# Altium schematic sheet microcontroller.SchDoc: microcontroller
size A2; CheckedBy: DMH; Organization: Detex Corp; Address1: Detex Corp; Address2: 302 Detex Dr; Address3: New Braunfels, TX 78130; Address4: (830) 629-290; DocumentNumber: 107027; Revision: A1; SheetNumber: 2; SheetTotal: 5; ProjectName: EE Project - 1.17.2021.PrjPcb
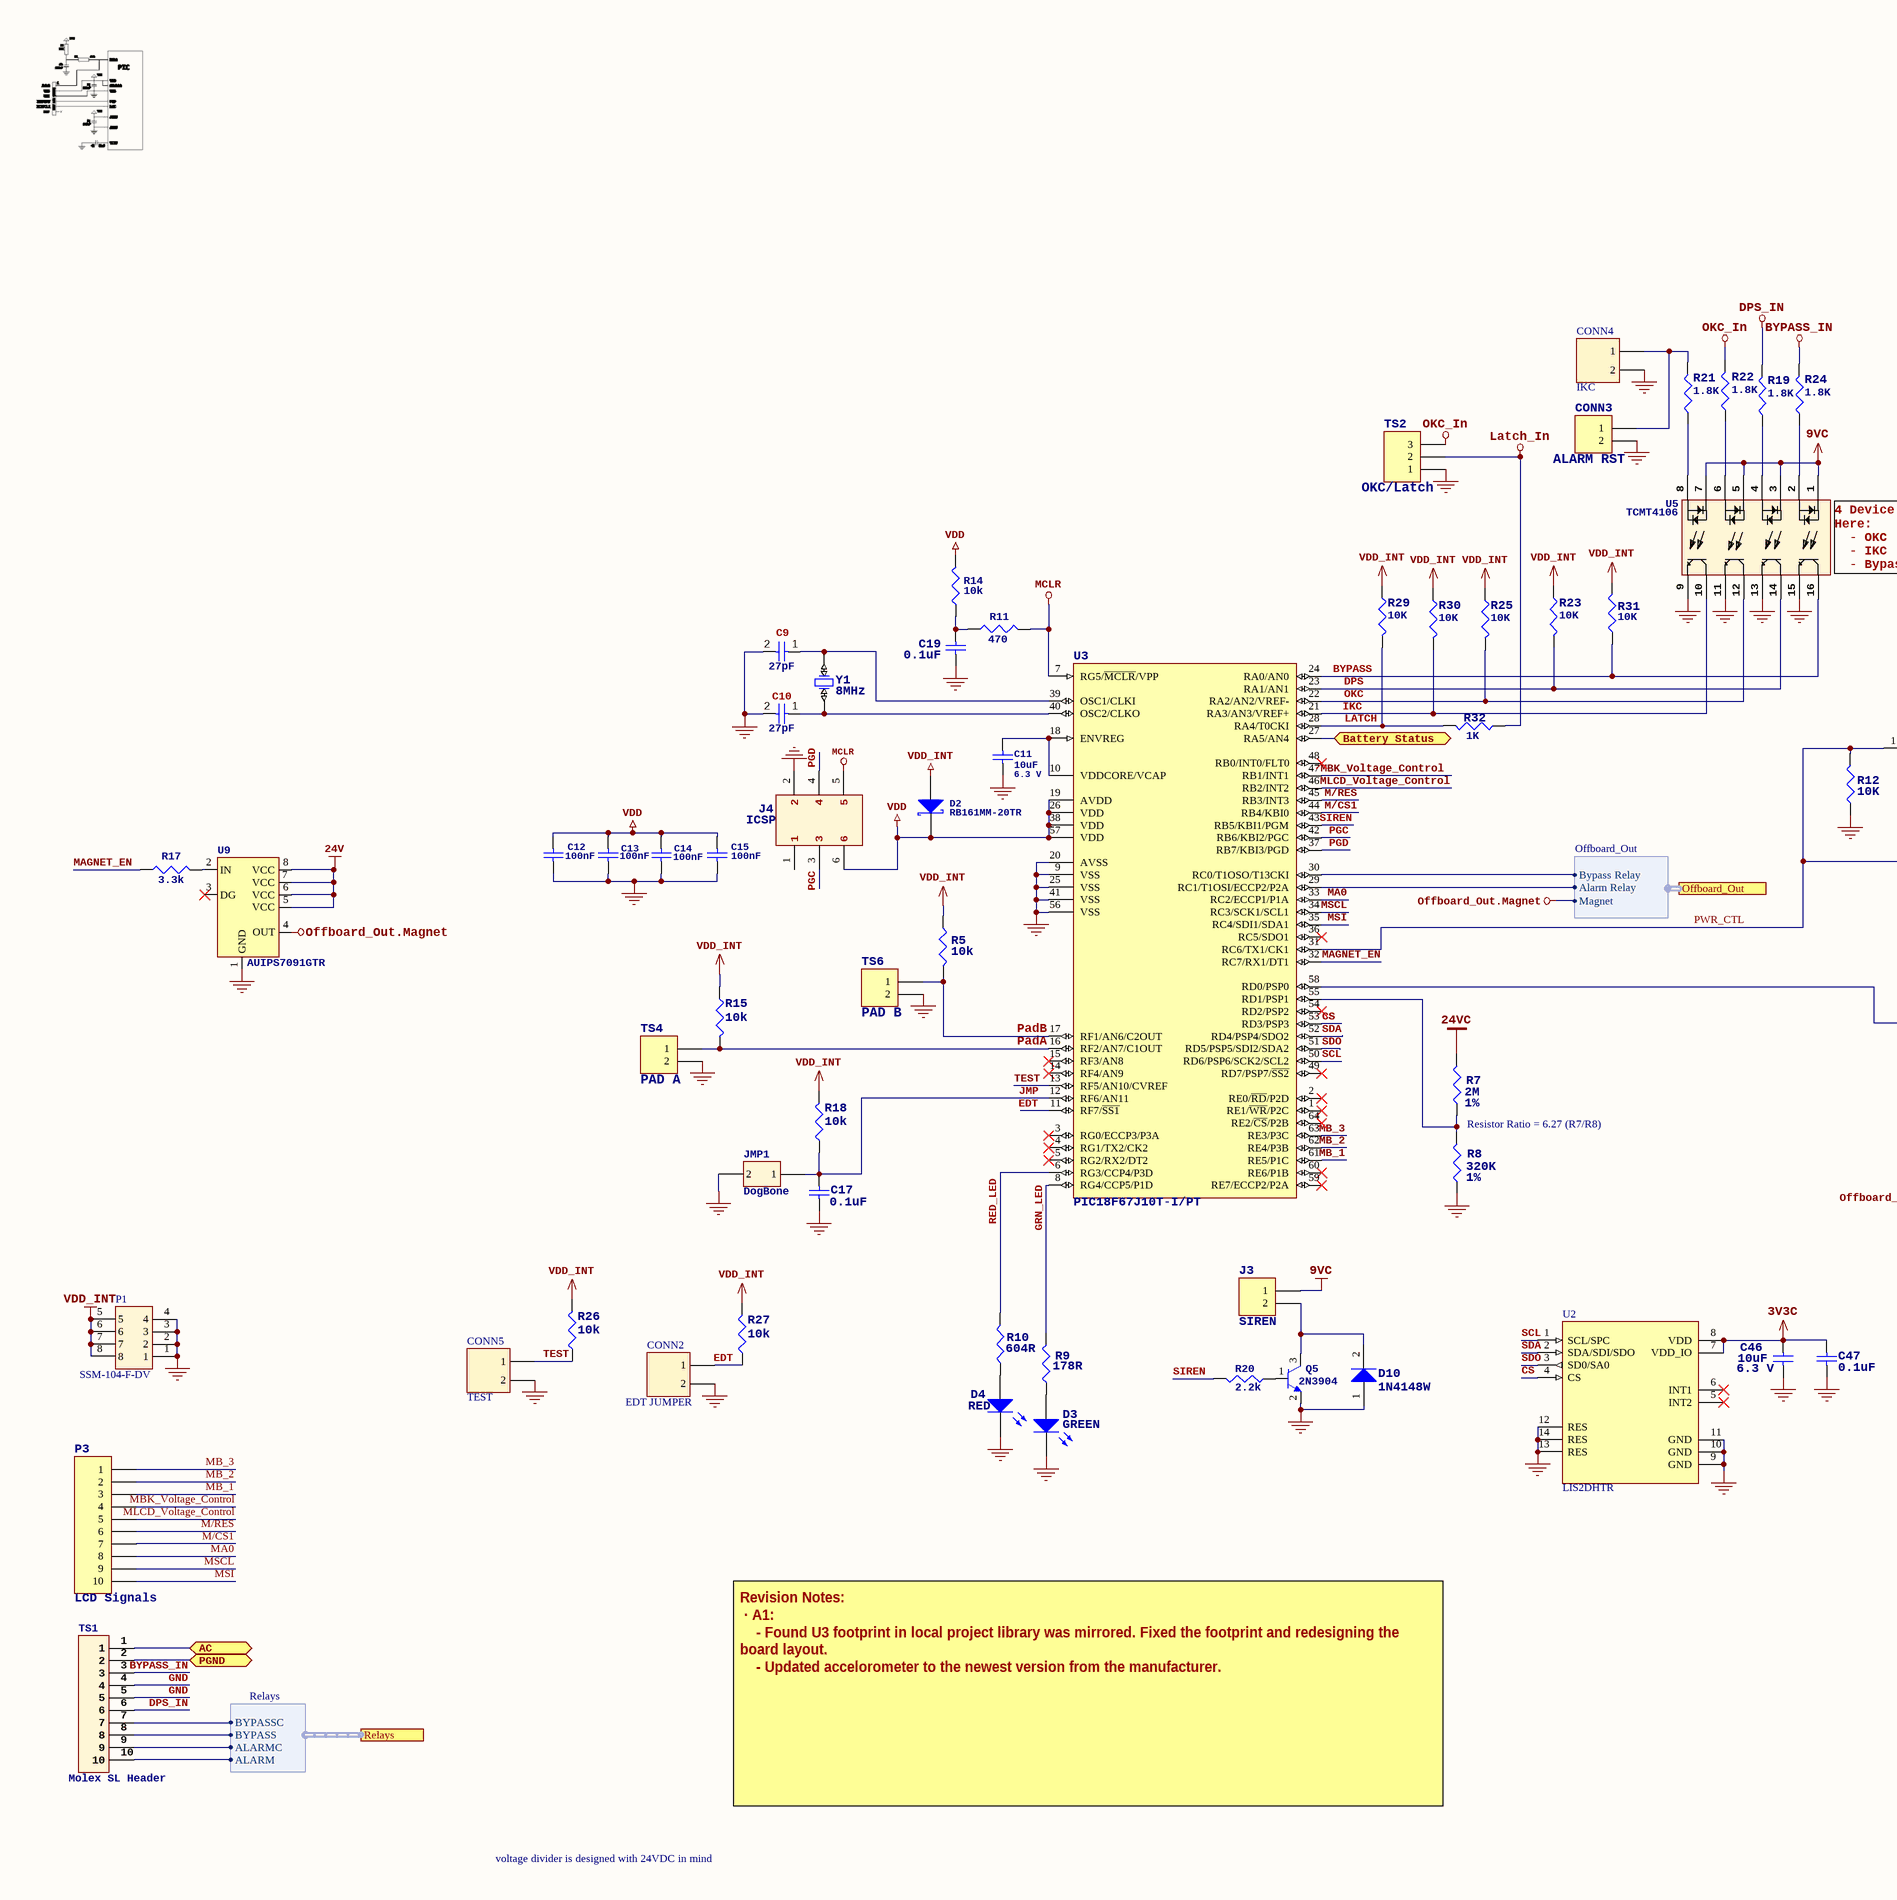
[diagram p0: microcontroller.SchDoc, left]
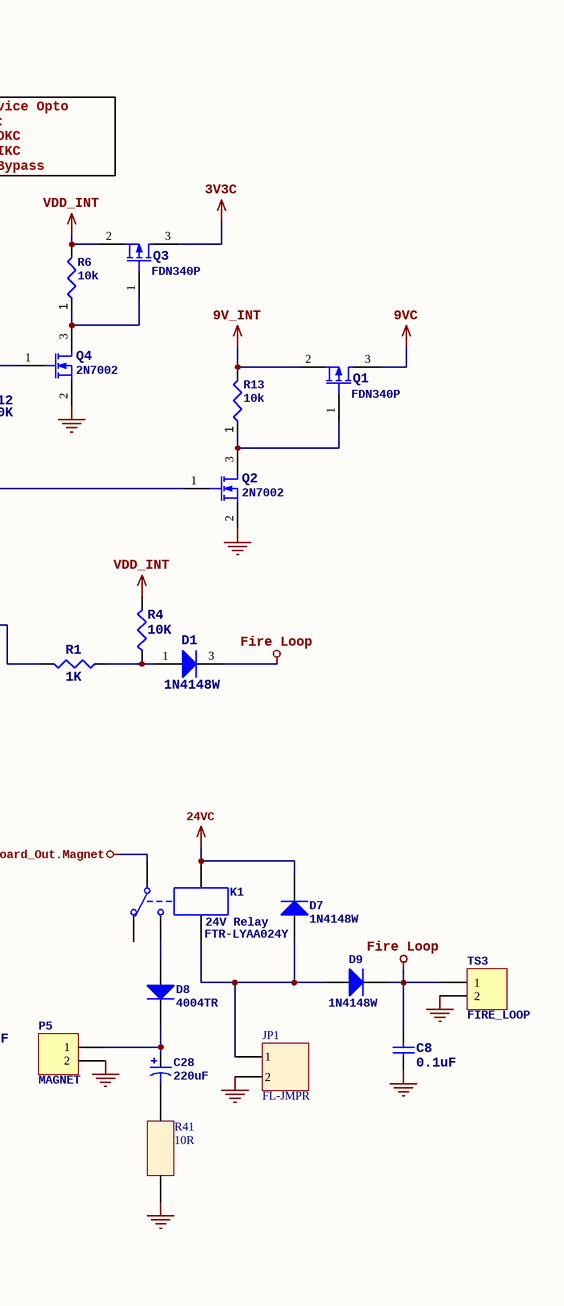
[diagram p1: microcontroller.SchDoc, right]

## Parts
C8  value 0.1uF  [C0805]  (hidden comment: Cap)
C9  value 27pF  [C0805]  (hidden comment: Cap)
C10  value 27pF  [C0805]  (hidden comment: Cap)
C11  value 10uF  Voltage: 6.3 V  [C0805]  (hidden comment: Cap)
C12  value 100nF  [C0805]  (hidden comment: Cap)
C13  value 100nF  [C0805]  (hidden comment: Cap)
C14  value 100nF  [C0805]  (hidden comment: Cap)
C15  value 100nF  [C0805]  (hidden comment: Cap)
C17  value 0.1uF  [C0805]  (hidden comment: Cap)
C19  value 0.1uF  [C0805]  (hidden comment: Cap)
C28  value 220uF  [10x12.5 CAP]  (hidden comment: Cap Pol3)
C46  value 10uF  Voltage: 6.3 V  [C0805]  (hidden comment: Cap)
C47  value 0.1uF  [C0805]  (hidden comment: Cap)
CONN2  EDT JUMPER  [2 Pin Header]
CONN3  ALARM RST  [BAT-2]  (no BOM)
CONN4  IKC  [2 Pin Header]
CONN5  TEST  [2 Pin Header]
D1  MFR P/N: 1N4148W  [SOT-23_M]  (hidden comment: Diode)
D2  MFR P/N: RB161MM-20TR  [SOD-123FL]  (hidden comment: D Schottky)
D3  GREEN  [T-1 3/4]
D4  RED  [T-1 3/4]
D7  MFR P/N: 1N4148W  [SOT-23_M]  (hidden comment: Diode)
D8  MFR P/N: 4004TR  [SMB]  (hidden comment: Diode)
D9  MFR P/N: 1N4148W  [SOT-23_M]  (hidden comment: Diode)
D10  MFR P/N: 1N4148W  [SOT-23_M]  (hidden comment: Diode)
J3  SIREN  [BAT-2]  (no BOM)
J4  ICSP  [ICSP SMT]  (no BOM)
JMP1  DogBone  [DogBone]  (no BOM)
JP1  FL-JMPR  [2 Pin Header]
K1  24V Relay  MFR P/N: FTR-LYAA024Y  [FTR-LY]
P1  MFR P/N: SSM-104-F-DV  [MOLEX 15453508]  (hidden comment: LCD Power)
P3  LCD Signals  [10 pin Header]
P5  MAGNET  [7025]
Q1  FDN340P  [SOT-23_N]
Q2  2N7002  [SOT-23_N]
Q3  FDN340P  [SOT-23_N]
Q4  2N7002  [SOT-23_N]
Q5  2N3904  [SOT-23_N]
R1  value 1K  [6-0805_N]  (hidden comment: Res3)
R4  value 10K  [6-0805_N]  (hidden comment: Res3)
R5  value 10k  [6-0805_N]  (hidden comment: Res3)
R6  value 10k  [6-0805_N]  (hidden comment: Resistor 10k +/-1% 0805)
R7  1%  value 2M  [6-0805_N]
R8  1%  value 320K  [6-0805_N]
R9  value 178R  [6-0805_N]  (hidden comment: Res3)
R10  value 604R  [6-0805_N]  (hidden comment: Res3)
R11  value 470  [6-0805_N]  (hidden comment: Resistor 1k +/-1% 0603 100 mW)
R12  value 10K  [6-0805_N]  (hidden comment: Res3)
R13  value 10k  [6-0805_N]  (hidden comment: Resistor 10k +/-1% 0805)
R14  value 10k  [6-0805_N]  (hidden comment: Resistor 10k +/-1% 0805)
R15  value 10k  [6-0805_N]  (hidden comment: Res3)
R17  value 3.3k  [6-0805_N]  (hidden comment: Res3)
R18  value 10k  [6-0805_N]  (hidden comment: Res3)
R19  value 1.8K  [6-0805_N]  (hidden comment: Res3)
R20  value 2.2k  [6-0805_N]  (hidden comment: Resistor 2.2k +/-5% 0805)
R21  value 1.8K  [6-0805_N]  (hidden comment: Res3)
R22  value 1.8K  [6-0805_N]  (hidden comment: Res3)
R23  value 10K  [6-0805_N]  (hidden comment: Res3)
R24  value 1.8K  [6-0805_N]  (hidden comment: Res3)
R25  value 10K  [6-0805_N]  (hidden comment: Res3)
R26  value 10k  [6-0805_N]  (hidden comment: Res3)
R27  value 10k  [6-0805_N]  (hidden comment: Res3)
R29  value 10K  [6-0805_N]  (hidden comment: Res3)
R30  value 10K  [6-0805_N]  (hidden comment: Res3)
R31  value 10K  [6-0805_N]  (hidden comment: Res3)
R32  value 1K  [6-0805_N]  (hidden comment: Res3)
R41  10R  [RESC_1210]
TS1  Molex SL Header  [10 Pin Molex Horizontal - duplicate]
TS2  OKC/Latch  [3 Pin Footprint]
TS3  FIRE_LOOP  [BAT-2]
TS4  PAD A  [BAT-2]
TS6  PAD B  [BAT-2]
U2  LIS2DHTR  [PQFN35P200X200X100-14N]
U3  PIC18F67J10T-I/PT  [PIC18F67J10T-I/PT]
U5  TCMT4106  [SSOP-16]
U9  AUIPS7091GTR  [SOIC127P600X175-8N]
Y1  8MHz  [ABM3]

## Ports
AC (bidir), Battery Status (bidir), Offboard_Out (harness Offboard_Out), PGND (bidir), Relays (harness Relays)

## Harnesses
Offboard_Out: Alarm Relay, Bypass Relay, Magnet
Relays: ALARMC, ALARM, BYPASSC, BYPASS

## Nets
3V3C: C46.1 C47.1 Q3.3(D) U2.7(VDD_IO) U2.8(VDD)
9V_INT: Q1.2(S) R13.2
9VC: J3.1 Q1.3(D) U5.1 U5.3 U5.5 U5.7
24V: U9.5(VCC) U9.6(VCC) U9.7(VCC) U9.8(VCC)
24VC: D7.2(K) K1.4 R7.2
BYPASS_IN: R24.2 TS1.3
DPS_IN: R19.2 TS1.6
Fire Loop: C8.1 D1.3 D9.2 TS3.1
GND: C8.2 C9.2 C10.2 C11.2 C12.2 C13.2 C14.1 C15.2 C17.2 C19.2 C46.2 C47.2 CONN2.2 CONN3.2 CONN4.2 CONN5.2 D3.2(K) D4.2(K) D10.1 J4.2 JMP1.2 JP1.2 P1.1 P1.2 P1.3 P1.4 P5.2 Q2.2(S) Q4.2(S) Q5.2(E) R8.1 R12.1 R41.2 TS1.4 TS1.5 TS2.1 TS3.2 TS4.2 TS6.2 U2.9(GND) U2.10(GND) U2.11(GND) U2.12(RES) U2.13(RES) U2.14(RES) U3.9(VSS) U3.20(AVSS) U3.25(VSS) U3.41(VSS) U3.56(VSS) U5.9 U5.11 U5.13 U5.15 U9.1(GND)
Latch_In: R32.1 TS2.2
MCLR: J4.5 R11.2 U3.7(RG5/~{MCLR}/VPP)
Offboard_Out.Magnet: K1.1 U9.4(OUT) ; port Offboard_Out.Magnet
OKC_In: R22.2 TS2.3
VDD: C12.1 C13.1 C14.2 C15.1 D2.1 J4.6 R14.2 U3.19(AVDD) U3.26(VDD) U3.38(VDD) U3.57(VDD)
VDD_INT: D2.2 P1.5 P1.6 P1.7 P1.8 Q3.2(S) R4.2 R5.1 R6.2 R15.1 R18.2 R23.1 R25.1 R26.2 R27.2 R29.1 R30.1 R31.2
AC: TS1.1 ; port AC
Battery Status: U3.27(RA5/AN4) ; port Battery Status
BYPASS: R31.1 U3.24(RA0/AN0) U5.16
CS: U2.4(CS) U3.53(RD3/PSP3)
DPS: R23.2 U3.23(RA1/AN1) U5.14
EDT: CONN2.1 R27.1 U3.11(RF7/~{SS1})
GRN_LED: R9.2 U3.8(RG4/CCP5/P1D)
IKC: R30.2 U3.21(RA3/AN3/VREF+) U5.10
JMP: C17.1 JMP1.1 R18.1 U3.12(RF6/AN11)
LATCH: R29.2 R32.2 U3.28(RA4/T0CKI)
M/CS1: P3.7 U3.44(RB4/KBI0)
M/RES: P3.6 U3.45(RB3/INT3)
MA0: P3.8 U3.33(RC2/ECCP1/P1A)
MAGNET_EN: R17.1 U3.32(RC7/RX1/DT1)
MB_1: P3.3 U3.61(RE5/P1C)
MB_2: P3.2 U3.62(RE4/P3B)
MB_3: P3.1 U3.63(RE3/P3C)
MBK_Voltage_Control: P3.4 U3.47(RB1/INT1)
MLCD_Voltage_Control: P3.5 U3.46(RB2/INT2)
MSCL: P3.9 U3.34(RC3/SCK1/SCL1)
MSI: P3.10 U3.35(RC4/SDI1/SDA1)
OKC: R25.2 U3.22(RA2/AN2/VREF-) U5.12
PadA: R15.2 TS4.1 U3.16(RF2/AN7/C1OUT)
PadB: R5.2 TS6.1 U3.17(RF1/AN6/C2OUT)
PGC: J4.3 U3.42(RB6/KBI2/PGC)
PGD: J4.4 U3.37(RB7/KBI3/PGD)
PGND: TS1.2 ; port PGND
PWR_CTL: Q2.1(G) Q4.1(G) R12.2 U3.31(RC6/TX1/CK1)
RED_LED: R10.2 U3.6(RG3/CCP4/P3D)
SCL: U2.1(SCL/SPC) U3.50(RD6/PSP6/SCK2/SCL2)
SDA: U2.2(SDA/SDI/SDO) U3.52(RD4/PSP4/SDO2)
SDO: U2.3(SD0/SA0) U3.51(RD5/PSP5/SDI2/SDA2)
SIREN: R20.2 U3.43(RB5/KBI1/PGM)
TEST: CONN5.1 R26.1 U3.13(RF5/AN10/CVREF)
NetC9_1: C9.1 U3.39(OSC1/CLKI) Y1.1(OSC1)
NetC10_1: C10.1 U3.40(OSC2/CLKO) Y1.2(OSC2)
NetC11_1: C11.1 U3.10(VDDCORE/VCAP) U3.18(ENVREG)
NetC19_1: C19.1 R11.1 R14.1
NetC28_1: C28.1 D8.2(K) P5.1
NetC28_2: C28.2 R41.1
NetCONN3_1: CONN3.1 CONN4.1 R21.2
NetD1_1: D1.1 R1.1 R4.1
NetD3_1: D3.1(A) R9.1
NetD4_1: D4.1(A) R10.1
NetD7_1: D7.1(A) D9.1 JP1.1 K1.5
NetD8_1: D8.1(A) K1.3
NetD10_2: D10.2 J3.2 Q5.3(C)
NetQ1_1: Q1.1(G) Q2.3(D) R13.1
NetQ3_1: Q3.1(G) Q4.3(D) R6.1
NetQ5_1: Q5.1(B) R20.1
NetR1_2: R1.2 U3.58(RD0/PSP0)
NetR7_1: R7.1 R8.2 U3.55(RD1/PSP1)
NetR17_2: R17.2 U9.2(IN)
NetR19_1: R19.1 U5.4
NetR21_1: R21.1 U5.8
NetR22_1: R22.1 U5.6
NetR24_1: R24.1 U5.2
NetTS1_7: TS1.7 ; port Relays.BYPASSC
NetTS1_8: TS1.8 ; port Relays.BYPASS
NetTS1_9: TS1.9 ; port Relays.ALARMC
NetTS1_10: TS1.10 ; port Relays.ALARM
NetU3_29: U3.29(RC1/T1OSI/ECCP2/P2A) ; port Offboard_Out.Alarm Relay
NetU3_30: U3.30(RC0/T1OSO/T13CKI) ; port Offboard_Out.Bypass Relay

Not connected (* = marked no-connect by the designer): J4 1; K1 2; U2 5(INT2)* 6(INT1)*; U3 1(RE1/~{WR}/P2C)* 2(RE0/~{RD}/P2D)* 3(RG0/ECCP3/P3A)* 4(RG1/TX2/CK2)* 5(RG2/RX2/DT2)* 14(RF4/AN9)* 15(RF3/AN8)* 36(RC5/SDO1)* 48(RB0/INT0/FLT0)* 49(RD7/PSP7/~{SS2})* 54(RD2/PSP2)* 59(RE7/ECCP2/P2A)* 60(RE6/P1B)* 64(RE2/~{CS}/P2B)*; U9 3(DG)*

## Notes on the sheet
- (near U5) 4 Device Opto Here:
  - OKC
  - IKC
  - Bypass
  - DPS
- Resistor Ratio = 6.27 (R7/R8)
- Revision Notes:
  ∙ A1:
  - Found U3 footprint in local project library was mirrored. Fixed the footprint and redesigning the board layout.
  - Updated accelorometer to the newest version from the manufacturer.
- voltage divider is designed with 24VDC in mind
- Title
- Detex Corp
- Size:
- Date:
- File:
- A2
- Number:
- Time:
- Sheet
- Revision:
- of
- 302 Detex Drive
- New Braunfels, TX 78130
- (830) 629-2900

## Library data of the parts
C8 C17 C19 C47 = Cap: Capacitor Ceramic X7R 50V 0.1uF 0805 SMT; MFR: KEMET; MFR P/N: C0805C104K4RACTU; Detex P/N: 101727‐7; PackageReference: 0805; ComponentLink1Description: Datasheet; PACKAGE: 0805; Case/Package: 0805; Mounting Technology: SMT
C9 C10 = CMP-001-00055-2: Multilayer Ceramic Capacitors MLCC - SMD/SMT 100V 27pF C0G 0805 5% AEC-Q200; MFR: AVX; MFR P/N: 08051A270J4T2A; Voltage Rating: 25V; Tolerance: 20%; Case/Package: 0805; Mounting Technology: SMT; Pins: 2
  C9: PACKAGE: 0805; PackageReference: 0805
  C10: PACKAGE: 0805 SMD 1/8W
C11 C46 = Cap: Multilayer Ceramic Capacitors MLCC - SMD/SMT CGA 0805 6.3V 10uF X7R 10% AEC-Q200; MFR: TDK; MFR P/N: CGA4J1X7R0J106K125AC; PackageReference: 0805; Detex P/N: *; ComponentLink1Description: Datasheet; ComponentLink1URL: https://product.tdk.com/info/en/catalog/datasheets/mlcc_automotive_general_en.pdf?ref_disty=mouser; PACKAGE: 0805; Case/Package: 0805; Mounting Technology: SMT
C12-C15 = Cap: Capacitor; Detex P/N: 101727-1; PackageReference: 0805; ComponentLink1Description: Datasheet; PACKAGE: 0805; Case/Package: 0805; Mounting Technology: SMT
C28 = Cap Pol3: Polarized Capacitor (Surface Mount); MFR: Nichicon; MFR P/N: URZ2A221MHD; PACKAGE: 10x12.5mm Electrolytic Capacitor; Detex P/N: *; ComponentLink1Description: Datasheet; PackageReference: Radial; Case/Package: Radial
CONN2 CONN4 CONN5 JP1 = Header 2: 2.54mm Pitch 2 Way 1 Row Straight Pin Header, Through Hole; MFR: TE Connectivity; MFR P/N: 5-146285-2; Detex P/N: *
  CONN2 CONN4 CONN5: Mounting Technology: Thru-Hole
CONN3 J3 = Header 2: Header, 2-Pin; Detex P/N: *; Mounting Technology: Thru-Hole
  J3: ComponentLink1Description: Datasheet
D1 D7 D9 D10 = Diode: DIODE SIGNAL SMT 75 VOLTS; pin to pad: 2>3; Detex P/N: PP-5932-1; ComponentLink1Description: Datasheet; PACKAGE: SOT-23-3; Case/Package: SOT-23; Mounting Technology: SMT
D2 = D Schottky: Schottky Barrier Rectifier; MFR: ROHM Semiconductor; ComponentLink1Description: Datasheet; ComponentLink1URL: https://www.mouser.com/datasheet/2/348/rb161mm-20tr-e-1870160.pdf; PACKAGE: SOD-123FL; Detex P/N: *; Case/Package: SOD-123; Mounting Technology: SMT
D3 = LED2: Typical RED, GREEN, YELLOW, AMBER GaAs LED; MFR: Kingbright; MFR P/N: WP7113LZGCK; Detex P/N: 102671-2; Forward Voltage: 2.65V; ComponentLink1Description: Datasheet; PACKAGE: T-1 3/4; Case/Package: T-1 3/4
D4 = LED2: Typical RED, GREEN, YELLOW, AMBER GaAs LED; MFR: Kingbright; MFR P/N: WP7113LSECK/J3; Detex P/N: 102671-1; Forward Voltage: 1.8V; ComponentLink1Description: Datasheet; PACKAGE: T-1 3/4; Case/Package: T-1 3/4
D8 = Diode: DIODE RECTIFIER 4004 SMT; Detex P/N: PP‐5970‐2; ComponentLink1Description: Datasheet; PACKAGE: SMB; Case/Package: SMB; Mounting Technology: SMT
J4 = ICSP_PIC: ICSP Header, 6-Pin, 2 Row; ComponentLink1Description: Datasheet; Mounting Technology: Thru-Hole
K1 = Relay-SPDT: SPST (1 Form A); MFR: Fujitsu; Detex P/N: 106224; ComponentLink1Description: Datasheet; ComponentLink1URL: http://www.rmorais.utad.pt/RMPDFFiles/PDFDatasheets/FTR-LY.pdf; Mounting Technology: Thru-Hole
P1 = 2x4 Header: MFR: Samtec; ComponentLink1Description: Datasheet; ComponentLink1URL: https://www.mouser.com/datasheet/2/527/ssm_sm-1317000.pdf; Detex P/N: *; Mounting Technology: SMT
P3 = Header 10: Headers & Wire Housings 10 PIN SIL VERTICAL SOCKET; MFR: Harwin; MFR P/N: M20-7821042; Detex P/N: *; Mounting Technology: Thru-Hole
P5 TS6 = Header 2: Header, 2-Pin; MFR: Molex; Detex P/N: 103520-2; ComponentLink1Description: Datasheet; MFR P/N: 22-05-7025; Mounting Technology: Thru-Hole
Q1 Q3 = MOSFET-P: P-Channel MOSFET; MFR P/N: NDS0605; MFR: ON Semiconductor / Fairchild; ComponentLink1Description: Datasheet; ComponentLink1URL: https://www.mouser.com/datasheet/2/308/NDS0605-1125221.pdf; PACKAGE: SOT-23; Detex P/N: *; Case/Package: SOT-23-3; Mounting Technology: SMT
Q2 Q4 = MOSFET-N: N-Channel MOSFET; MFR: ON Semiconductor; Detex P/N: 101676; ComponentLink1Description: Datasheet; ComponentLink1URL: https://www.mouser.com/datasheet/2/308/NDS7002A-D-1522662.pdf; MFR P/N: 2N7002; PACKAGE: SOT-23; Case/Package: SOT-23-3; Mounting Technology: SMT
Q5 = 2N3904_SMT: NPN Darlington Bipolar Transistor; MFR P/N: MMBT3904; Value: MMBT2222; Detex P/N: PP-5933-1; Pin Count: 3; Design Item ID: 2N3904_SMT; Package: SOT-23; Case/Package: SOT-23-3; Mounting Technology: SMT
R1 R32 = Res3: Resistor 1K Ohm 1% 0805 SMT; MFR: Vishay/Dale; MFR P/N: CRCW08051K00FKEA; Detex P/N: 101734-12; ComponentLink1Description: Datasheet; PACKAGE: 0805 SMD 1/8W; PackageReference: 0805; Case/Package: 0805; Mounting Technology: SMT
R4 R5 R12 R15 R18 R23 R25-R27 R29-R31 = Res3: Resistor; ComponentLink1Description: Datasheet; PACKAGE: 0805 SMD 1/8W; Detex P/N: *; Case/Package: 0805; Mounting Technology: SMT
  R23 R25 R29-R31: PackageReference: 0805
R6 R13 R14 = CMP-009-00017-4: Chip Resistor, 10 KOhm, +/- 1%, 01 W, -55 to 155 degC, 0805; Voltage Rating: 50V; Power: 100mW; Tolerance: 1%; Case/Package: 0805; Pins: 2; Mounting Technology: SMT; PACKAGE: 0805 SMD 1/8W
R7 = Res3: Resistor 2M Ohm 1% 0805 SMT; MFR: Vishay/Dale; MFR P/N: CRCW08052M00FKEA; Detex P/N: 101734-25; ComponentLink1Description: Datasheet; PACKAGE: 0805 SMD 1/8W; Case/Package: 0805; Mounting Technology: SMT
R8 = Res3: Thin Film Resistors - SMD 1/8W 316K ohm 1% 50ppm; MFR: Yageo; MFR P/N: RT0805FRE07316KL; ComponentLink1Description: Datasheet; ComponentLink1URL: https://www.mouser.com/datasheet/2/447/PYu-RT_1-to-0.01_RoHS_L_11-1669912.pdf; PACKAGE: 0805 SMD 1/8W; Detex P/N: *; Case/Package: 0805; Mounting Technology: SMT
R9 = Res3: Resistor; MFR: Vishay / Dale; MFR P/N: CRCW0805178RFKEA; ComponentLink1Description: Datasheet; PACKAGE: 0805 SMD 1/8W; Detex P/N: *; Case/Package: 0805; Mounting Technology: SMT
R10 = Res3: Thick Film Resistors - SMD 1/8Watt 604ohms 1%; MFR: Vishay / Dale; MFR P/N: CRCW0805604RFKEAC; ComponentLink1Description: Datasheet; PACKAGE: 0805 SMD 1/8W; Detex P/N: *; Case/Package: 0805; Mounting Technology: SMT
R11 = CMP-009-00014-4: Chip Resistor, 1 KOhm, +/-1%, 0.1 W, -55 to 155 degC, 0603 (1608 Metric); MFR: Vishay/Dale; MFR P/N: CRCW0805470RFKEA; Power: 100mW; Tolerance: 1%; Voltage Rating: 50V; Detex P/N: 101734-10; Pins: 2; Case/Package: 0805; Mounting Technology: SMT; PACKAGE: 0805
R17 = Res3: Resistor 3.3KOhm 5% 0805 SMT; MFR: Vishay/Dale; MFR P/N: CRCW08053K30JNEA; Detex P/N: 101734-4; ComponentLink1Description: Datasheet; PACKAGE: 0805 SMD 1/8W; PackageReference: 0805; Case/Package: 0805; Mounting Technology: SMT
R19 R21 R22 = Res3: Resistor; MFR: Vishay / Dale; MFR P/N: CRCW08051K82FKEA; Detex P/N: 101734-4; ComponentLink1Description: Datasheet; PACKAGE: 0805 SMD 1/8W; Case/Package: 0805; Mounting Technology: SMT
R20 = CMP-009-00017-4: Chip Resistor, 2.2KOhm, +/- 5%, 01 W, -55 to 155 degC, 0805; Tolerance: 1%; Voltage Rating: 50V; Power: 100mW; Case/Package: 0805; Pins: 2; Mounting Technology: SMT; Detex P/N: *; PACKAGE: 0805 SMD 1/8W
R24 = Res3: Resistor; MFR: Vishay / Dale; MFR P/N: CRCW08051K82FKEA; Detex P/N: 101734-13; ComponentLink1Description: Datasheet; PACKAGE: 0805 SMD 1/8W; Case/Package: 0805; Mounting Technology: SMT
R41 = RESC_1210: Resistor 10 Ohm 5% 1210 SMD; MFR: Vishay/Dale; MFR P/N: CRCW121010R0JNEA; Detex P/N: 101734-28; Case/Package: 1210; Mounting Technology: SMT; PACKAGE: 1210
TS1 = SPOX-10P: MFR P/N: 70555-0009; Detex P/N: *; MFR: Molex; Mounting Technology: Thru-Hole
TS2 = Header 3H: Header, 3-Pin, Right Angle; MFR: Molex; Detex P/N: *; MFR P/N: 22-05-7035; Mounting Technology: Thru-Hole
TS3 TS4 = Header 2H: Header, 2-Pin, Right Angle; Detex P/N: *
  TS3: Mounting Technology: Thru-Hole
U2 = LIS2DHTR: Accelerometer X, Y, Z Axis Â±2g, 4g, 8g, 16g 0.5Hz ~ 672Hz 14-LGA _2x2_; MF: STMicroelectronics; Package: LGA-14 STMicroelectronics; Value: *; MP: LIS2DHTR; SnapEDA_Link: https://www.snapeda.com/parts/LIS2DHTR/STMicroelectronics/view-part/45205/?ref=snap; ComponentLink1Description: Datasheet; ComponentLink1URL: https://www.st.com/content/ccc/resource/technical/document/datasheet/c1/e1/62/31/d2/b1/4d/bb/DM00042751.pdf/files/DM00042751.pdf/jcr:content/translations/en.DM00042751.pdf
U3 = CMP-0116-00693-1: High Performance, 1-Mbit Flash Microcontroller with nanoWatt Technology, 128K Flash, 64-Pin TQFP, Industrial Temperature Range, Tape and Reel; MFR: Microchip; ComponentLink1Description: Datasheet; ComponentLink1URL: http://www.microchip.com/mymicrochip/filehandler.aspx?ddocname=en022070; MFR P/N: PIC18F67J10; PACKAGE: 64 pin Microcontroller; Detex P/N: *; PackageReference: TQFP-64; Case/Package: TQFP-64; Mounting Technology: SMT
U5 = ILQ615-4X009: Transistor Output Optocouplers Phototransistor Out Quad CTR > 160-320%; MFR: Vishay Semiconductors; MFR P/N: TCMT4106; PACKAGE: SSOP-16; Detex P/N: *; Case/Package: SSOP-16; Mounting Technology: SMT
U9 = AUIPS7091GTR: High Side MOSFET Switcher; MFR: International Rectifier/Infineon; Detex P/N: 102475‐1; ComponentLink1Description: Datasheet; ComponentLink1URL: http://www.infineon.com/dgdl/ips511g.pdf?fileId=5546d462533600a4015355c3ba2f161b; MFR P/N: AUIPS7091GTR; PACKAGE: SOIC-8; Case/Package: SOIC-8; Mounting Technology: SMT
Y1 = XTAL: Crystal Oscillator 8MHz; MFR: Abracom; MFR P/N: ABM3AIG-8.000MHZ-8-K1Z-T; ComponentLink1Description: Datasheet; ComponentLink1URL: http://www.abracon.com/Resonators/abm3.pdf; PACKAGE: SMD 8MHz Crystal Ocsillator; Detex P/N: *; Case/Package: 2-SMD, No Lead; Mounting Technology: SMT